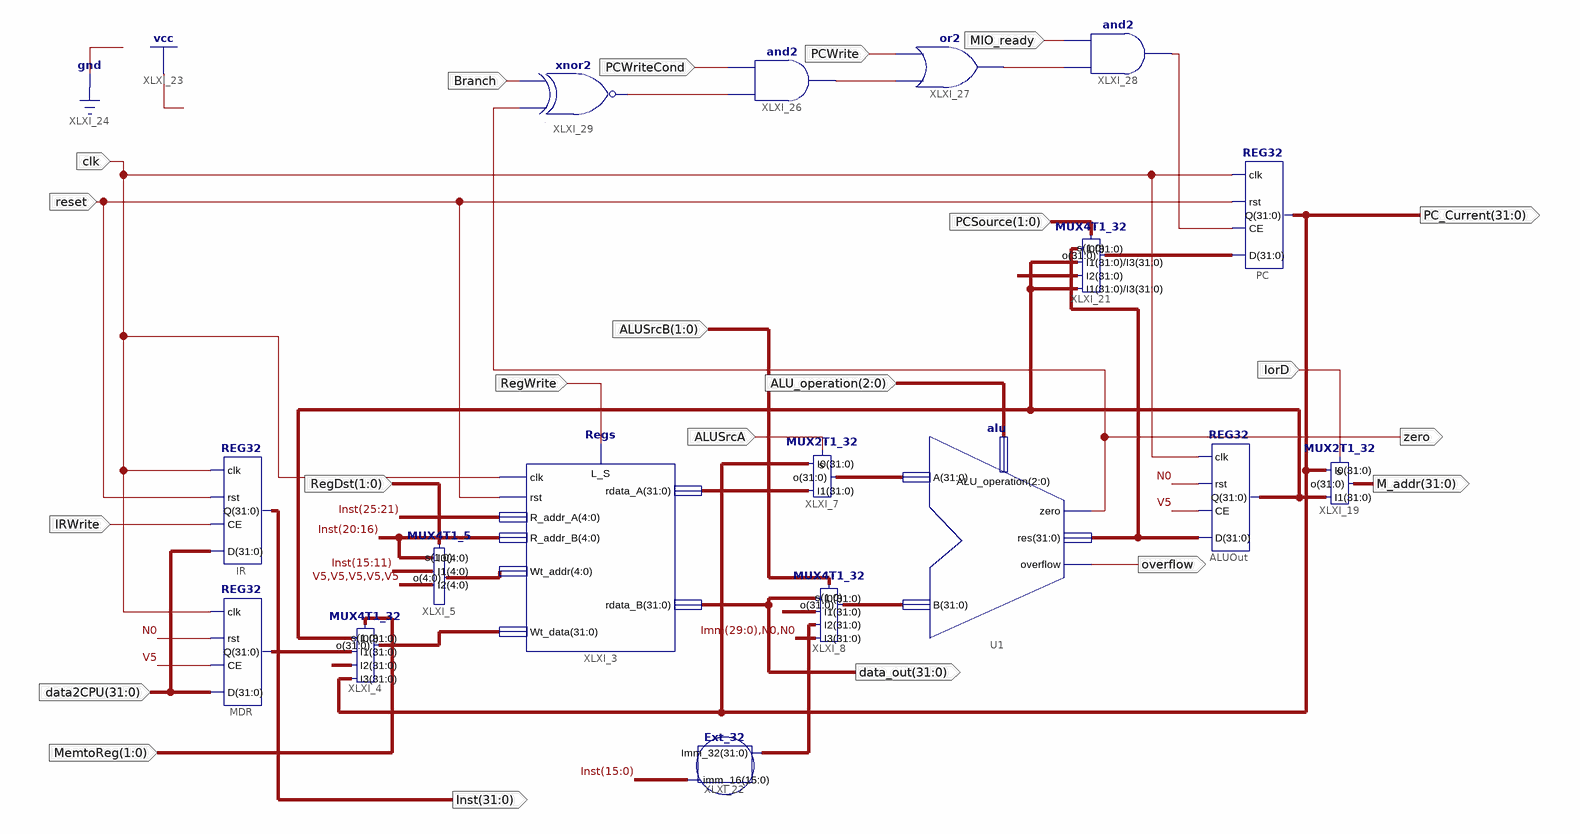
[diagram p0: schematic sheet 1]
// Xilinx ISE schematic M_datapath.sch (kintex7) as structural Verilog: 17 symbols, 22 ports
module M_datapath (
  input  clk,
  input  [1:0] PCSource,
  input  IorD,
  input  [1:0] ALUSrcB,
  input  ALUSrcA,
  input  RegWrite,
  input  [1:0] RegDst,
  input  [1:0] MemtoReg,
  input  IRWrite,
  input  [31:0] data2CPU,
  input  [2:0] ALU_operation,
  input  reset,
  input  Branch,
  input  PCWriteCond,
  input  PCWrite,
  input  MIO_ready,
  output [31:0] Inst,
  output [31:0] data_out,
  output overflow,
  output [31:0] PC_Current,
  output zero,
  output [31:0] M_addr
);

  wire XLXN_73, XLXN_75, XLXN_77, XLXN_79;
  wire [4:0] XLXN_32;
  wire [31:0] ALU_Out, Imm, res, XLXN_25, XLXN_41, XLXN_42, XLXN_43, XLXN_60, XLXN_80;

  Regs XLXI_3 (
    .clk(clk), .L_S(RegWrite), .rdata_A(XLXN_41), .rst(reset), .Wt_data(XLXN_80), .rdata_B(data_out),
    .R_addr_A(Inst[25:21]), .R_addr_B(Inst[20:16]), .Wt_addr(XLXN_32));
  REG32 IR (.D(data2CPU), .CE(IRWrite), .rst(reset), .clk(clk), .Q(Inst));
  REG32 PC (.D(XLXN_60), .CE(XLXN_79), .rst(reset), .clk(clk), .Q(PC_Current));
  MUX4T1_32 XLXI_21 (
    .s(PCSource), .I0(res), .I1(ALU_Out), .I2({PC_Current[31:28], Inst[25:0], 2'b00}), .I3(ALU_Out),
    .o(XLXN_60));
  Ext_32 XLXI_22 (.imm_16(Inst[15:0]), .Imm_32(Imm));
  REG32 MDR (.D(data2CPU), .CE(1'b1), .rst(1'b0), .clk(clk), .Q(XLXN_25));
  MUX4T1_32 XLXI_4 (
    .s(MemtoReg), .I0(ALU_Out), .I1(XLXN_25), .I2({Inst[15:0], {16{1'b0}}}), .I3(PC_Current), .o(XLXN_80));
  MUX4T1_5 XLXI_5 (.s(RegDst), .I1(Inst[15:11]), .I0(Inst[20:16]), .o(XLXN_32), .I2({5{1'b1}}));  // open: I3
  MUX4T1_32 XLXI_8 (
    .s(ALUSrcB), .I0(data_out), .I1(32'b00000000000000000000000000000100), .I2(Imm), .I3({Imm[29:0], 2'b00}),
    .o(XLXN_43));
  MUX2T1_32 XLXI_7 (.s(ALUSrcA), .I0(PC_Current), .I1(XLXN_41), .o(XLXN_42));
  alu U1 (.zero(zero), .res(res), .overflow(overflow), .A(XLXN_42), .B(XLXN_43), .ALU_operation(ALU_operation));
  MUX2T1_32 XLXI_19 (.s(IorD), .I0(PC_Current), .I1(ALU_Out), .o(M_addr));
  REG32 ALUOut (.D(res), .CE(1'b1), .rst(1'b0), .clk(clk), .Q(ALU_Out));
  and XLXI_26 (XLXN_75, XLXN_73, PCWriteCond);
  or XLXI_27 (XLXN_77, XLXN_75, PCWrite);
  and XLXI_28 (XLXN_79, XLXN_77, MIO_ready);
  xnor XLXI_29 (XLXN_73, zero, Branch);
endmodule
